# Altium schematic sheet Underwater_ROV_Servos.SchDoc
size A
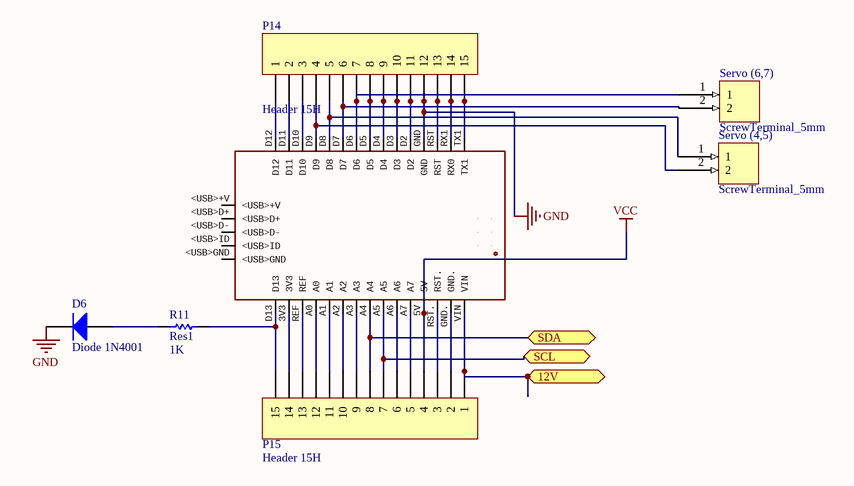
[diagram p0: Underwater_ROV_Servos.SchDoc]

## Parts
D6  Diode 1N4001  [DO-41]
Nano_servos  Device for representing an Arduino Nano board with a footprint in an EAGLE design. Created by Dave Young for Element14. More EAGLE documentation at: http://www.element14.com/community/community/knode/cadsoft_eagle  [ARDUINO_NANO]  (value not drawn)
P14  Header 15H  [HDR1X15H]
P15  Header 15H  [HDR1X15H]
R11  Res1  value 1K  [AXIAL-0.3]
Servo_(4,5)  ScrewTerminal_5mm  [Screw_Terminal_5mm]
Servo_(6,7)  ScrewTerminal_5mm  [Screw_Terminal_5mm]

## Ports
12V (bidir), SCL (bidir), SDA (bidir)

## Nets
GND: D6.2(K) Nano_servos.GND P14.12
VCC: Nano_servos.5V P15.4
12V: Nano_servos.VIN P15.1 ; port 12V
SCL: Nano_servos.A5 P15.7 ; port SCL
SDA: Nano_servos.A4 P15.8 ; port SDA
NetD6_1: D6.1(A) R11.1
NetNano_servos_3V3: Nano_servos.3V3 P15.14
NetNano_servos_A0: Nano_servos.A0 P15.12
NetNano_servos_A1: Nano_servos.A1 P15.11
NetNano_servos_A2: Nano_servos.A2 P15.10
NetNano_servos_A3: Nano_servos.A3 P15.9
NetNano_servos_A6: Nano_servos.A6 P15.6
NetNano_servos_A7: Nano_servos.A7 P15.5
NetNano_servos_D2: Nano_servos.D2 P14.11
NetNano_servos_D3: Nano_servos.D3 P14.10
NetNano_servos_D4: Nano_servos.D4 P14.9
NetNano_servos_D5: Nano_servos.D5 P14.8
NetNano_servos_D6: Nano_servos.D6 P14.7 Servo_(6,7).1
NetNano_servos_D7: Nano_servos.D7 P14.6 Servo_(6,7).2
NetNano_servos_D8: Nano_servos.D8 P14.5 Servo_(4,5).1
NetNano_servos_D9: Nano_servos.D9 P14.4 Servo_(4,5).2
NetNano_servos_D10: Nano_servos.D10 P14.3
NetNano_servos_D11: Nano_servos.D11 P14.2
NetNano_servos_D12: Nano_servos.D12 P14.1
NetNano_servos_D13: Nano_servos.D13 P15.15 R11.2
NetNano_servos_GND.: Nano_servos.GND. P15.2
NetNano_servos_REF: Nano_servos.REF P15.13
NetNano_servos_RST: Nano_servos.RST P14.13
NetNano_servos_RST.: Nano_servos.RST. P15.3
NetNano_servos_RX1: Nano_servos.RX1(RX0) P14.14
NetNano_servos_TX1: Nano_servos.TX1 P14.15

Not connected (* = marked no-connect by the designer): Nano_servos 5V. <USB>+V <USB>D+ <USB>D- <USB>GND <USB>ID GND_ MISO MOSI RESET.. SCK

## Library data of the parts
D6 = Diode 1N4001: 1 Amp General Purpose Rectifier; Published: 8-Jun-2000; LatestRevisionDate: 17-Jul-2002; LatestRevisionNote: Re-released for DXP Platform.; DatasheetVersion: 1998; PackageVersion: Aug-1999; PackageReference: DO-41; Publisher: Altium Limited; PackageDescription: Diode, Axial; Body 5.2 x 2.7 mm (LxDia. max), Lead Dia. 0.86 mm (max); Code_JEDEC: DO-204-AL; ComponentLink1Description: Manufacturer Link; ComponentLink1URL: http://www.fairchildsemi.com/; ComponentLink2Description: Datasheet; ComponentLink2URL: http://www.fairchildsemi.com/ds/1N%2F1N4001.pdf
Nano_servos = ARDUINO_NANO
P14 P15 = Header 15H: Header, 15-Pin, Right Angle; LatestRevisionDate: 17-Jul-2002; LatestRevisionNote: Re-released for DXP Platform.; Publisher: Altium Limited
R11 = Res1: Resistor; Published: 8-Jun-2000; LatestRevisionDate: 17-Jul-2002; LatestRevisionNote: Re-released for DXP Platform.; PackageReference: AXIAL-0.3; Publisher: Altium Limited; PackageDescription: Axial Device, Thru-Hole; 2 Leads; 0.3 in Pin Spacing